# EAGLE design zdroj5V (EAGLE 7.1.0)
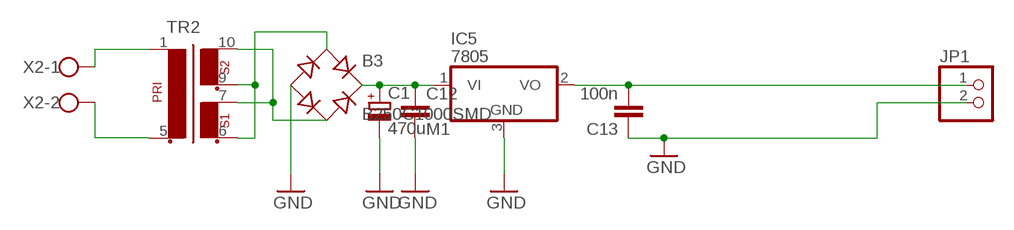
[diagram p0: schematic, sheet 1]

## Parts
B3  B250C1000SMD  RECTIFIER-B40S  [B40S]
C1  470u  CPOL-EUE5-10.5  [E5-10,5]
C12  M1  C-EUC1206  [C1206]
C13  100n  C-EUC1206  [C1206]
IC5  7805  7806DT  [TO252]
JP1  PINHD-1X2  [1X02]
TR2  EI30-2  [EI30-2]
X2  W237-102  [W237-102]

## Nets
GND: B3.- C1.- C12.2 C13.1 IC5.3(GND) JP1.2
N$2: B3.AC1 TR2.6 TR2.9
N$14: B3.+ C1.+ C12.1 IC5.1(VI)
N$20: B3.AC2 TR2.7 TR2.10
N$30: TR2.5 X2.2
N$31: TR2.1 X2.1
N$33: C13.2 IC5.2(VO) JP1.1

## Library data of the parts
B3 = rectifier:RECTIFIER-: Rectifier
C1 = rcl:CPOL-EU: POLARIZED CAPACITOR, European symbol
C12 C13 = rcl:C-EU: CAPACITOR, European symbol
IC5 = linear:78*: Positive VOLTAGE REGULATOR Source: http://cache.national.com/ds/LM/LM78L05.pdf http://www.fairchildsemi.com/ds/LM/LM7805.pdf
JP1 = pinhead:PINHD-1X2: PIN HEADER
TR2 = trafo:EI30-2: TRANSFORMER 1 primary winding, 2 secondary windings ERA
X2 = con-wago-500:W237-102: WAGO SCREW CLAMP; MPN: 237-102; OC_FARNELL: unknown; OC_NEWARK: 70K9898

## Board
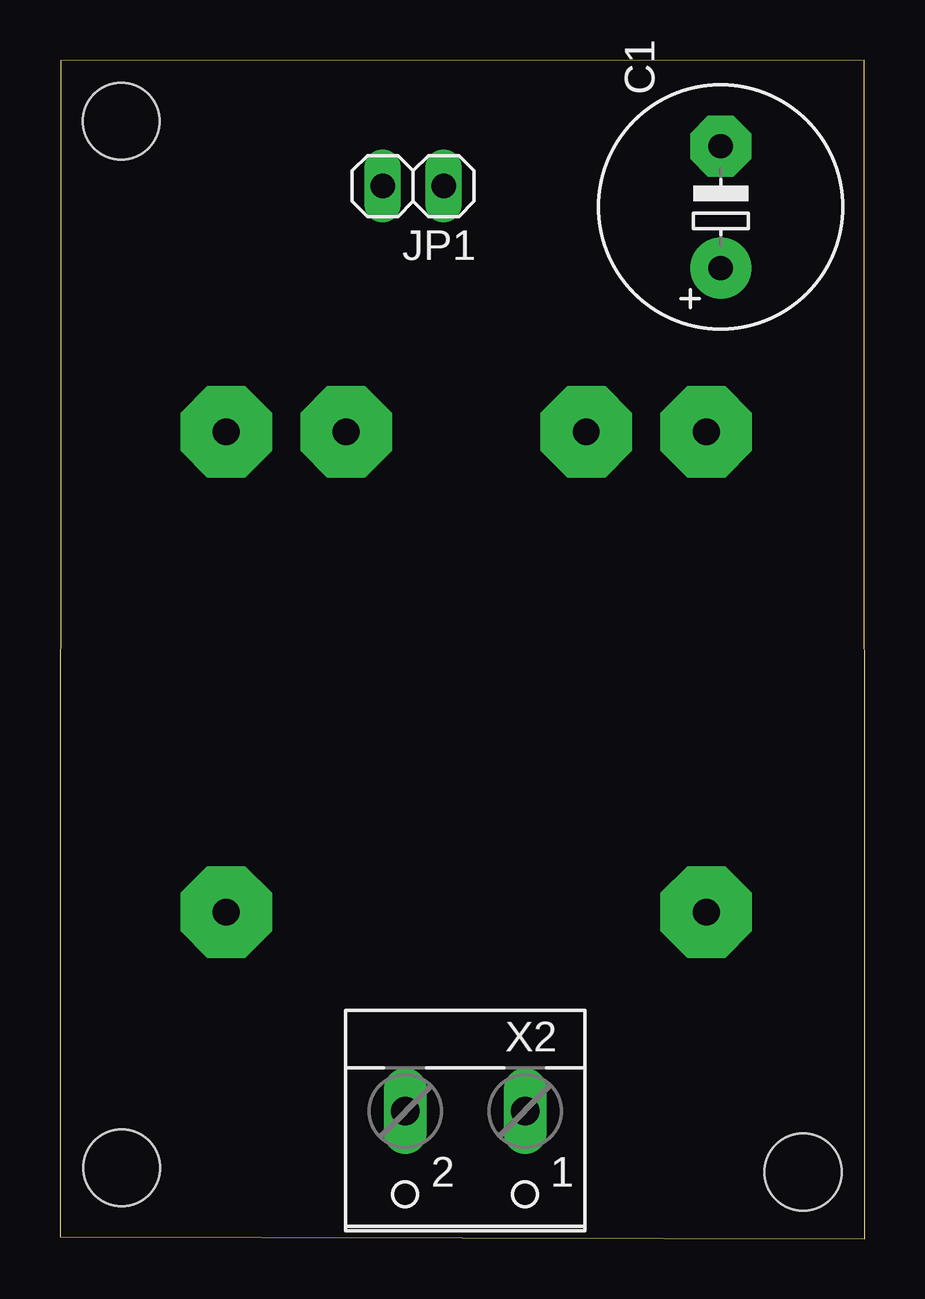
[diagram p1: board, top side]
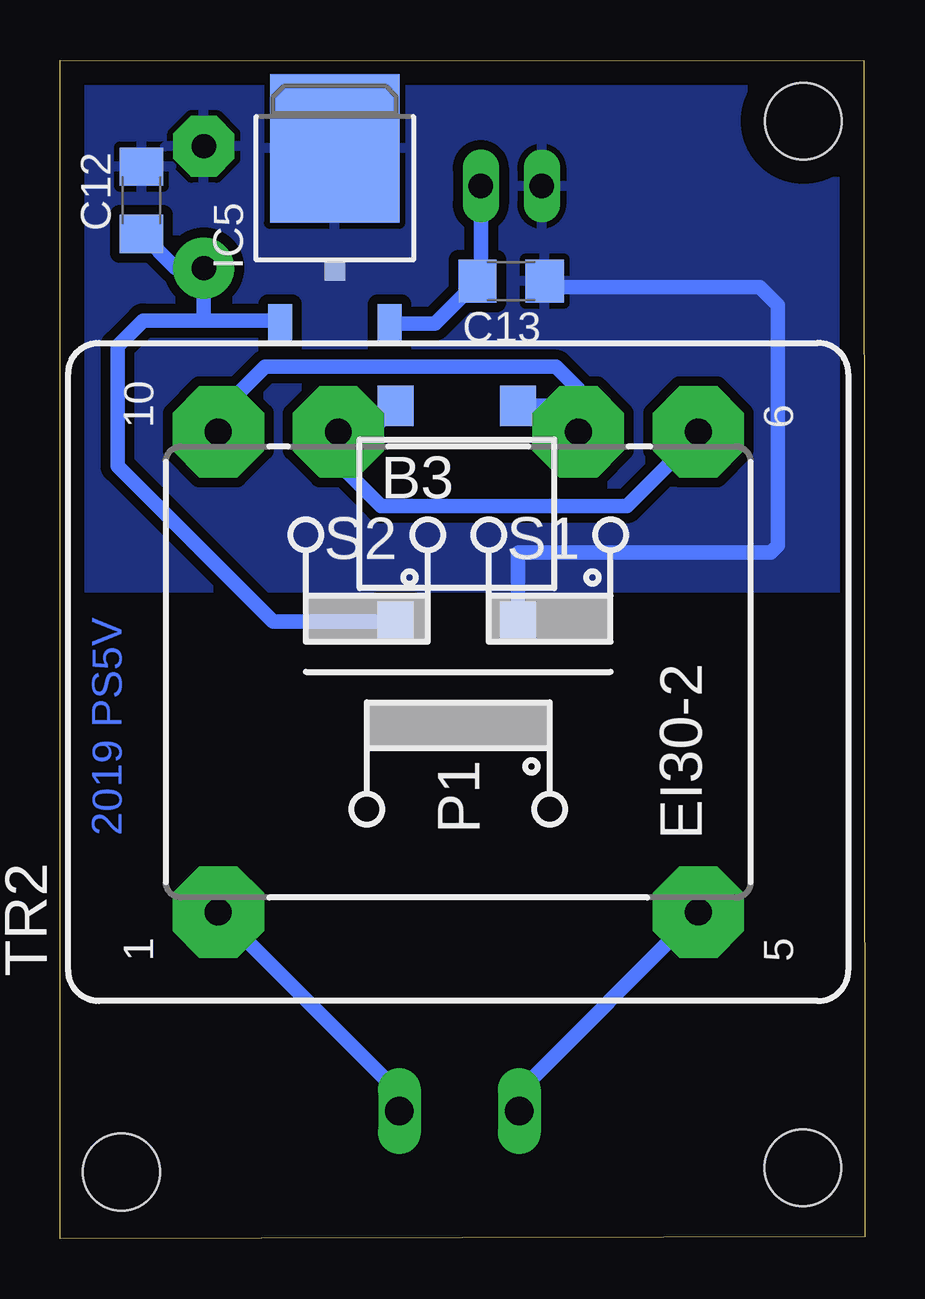
[diagram p2: board, bottom side, seen from below]

Size 33.54 x 49.13 mm. Coordinates in mm from the lower left corner, seen from the top.
Outline: 0,0.07 33.54,0 33.54,49.13 0.03,49.1 0,0.07
Copper layers (1*16): Top 0.035mm / dielectric 1.5mm / Bottom 0.035mm
Design rules "default": minimum track width 10mil, minimum drill 24mil, track to track 8mil, track to pad 8mil, pad to pad 8mil, via to via 8mil, smd to smd 8mil, copper to edge 40mil, drill to drill 8mil, minimum pad ring 10mil, minimum via ring 8mil, stop-mask expansion 4mil, vias tented up to drill 0mil, thermal gap 10mil
Holes 3.2 mm at 2.58,2.96 30.98,2.78 2.55,46.59

### Footprints (pad centres in the part's own frame; a part is rotated, then mirrored left to right if it is on the bottom)
B40S = smd 1.5 x 1.7: + -2.55,-4.5; - 2.55,-4.5; AC1 -2.55,4.5; AC2 2.55,4.5
E5-10,5 = drill 1.016 pad 2.54: + -2.54,0 | drill 1.016 pad 2.54 octagon: - 2.54,0
C1206 = smd 1.6 x 1.8: 1 -1.4,0; 2 1.4,0
TO252 = smd 1 x 1.6: 1 -2.28,-4.8; 2 2.28,-4.8 | smd 5.4 x 6.2: 3 0,2.5
1X02 = drill 1.016 long: 1 -1.27,0; 2 1.27,0
EI30-2 = drill 1.118 pad 3.81 octagon: 1 -10.008,10.008; 5 -10.008,-10.008; 6 10.008,-10.008; 7 10.008,-5.004; 9 10.008,5.004; 10 10.008,10.008
W237-102 = drill 1.194 long: 1 -2.5,-1.27; 2 2.5,-1.27

### Placement (x,y rotation side)
B3  17,30.22 0 bottom
C1  27.54,43 90 top
C12  30.14,43.29 90 bottom
C13  14.73,39.91 180 bottom
IC5  22.09,42.95 0 bottom
JP1  14.73,43.88 180 top
TR2  16.94,23.62 90 bottom
X2  16.89,4.06 180 top

### Tracks (layer width: path | path; a pad name or v marks a point on that pad's centre or on a via)
GND
  Bottom 0.61: B3.- 14.45,28.58 14.43,28.6 3.91,28.6 3.61,28.9 3.61,38.92 4.37,39.68 13.1,39.68 C13.1
  pour Bottom (isolate 0.406): -1,54.23 34.96,54.21 34.96,27.17 34.94,27.15 -0.91,27.15 -0.95,27.1 -0.95,54.22 -0.96,54.23
N$2
  Bottom 0.61: TR2.6 6.93,33.51 9.91,30.53 20.16,30.53 22.02,32.39 22.02,33.55 TR2.9 20.63,33.63 B3.AC1
N$14
  Bottom 0.61: B3.+ 24.66,25.72 31.14,32.2 31.14,37.21 30.08,38.27 27.57,38.27 | 27.57,38.27 24.49,38.27 IC5.1 | 27.57,38.27 27.55,38.3 C1.+ 28.72,40.46 C12.1
N$20
  Bottom 0.61: TR2.10 26.97,33.65 26.97,34.37 24.99,36.35 12.87,36.35 11.93,35.41 TR2.7 13.02,34.72 B3.AC2
N$30
  Bottom 0.61: X2.2 14.39,6.15 TR2.5
N$31
  Bottom 0.61: X2.1 19.39,6.07 TR2.1
N$33
  Bottom 0.61: IC5.2 17.9,38.15 C13.2 16,40.05 JP1.1

### Text on the board
Bottom: 2019 PS5V